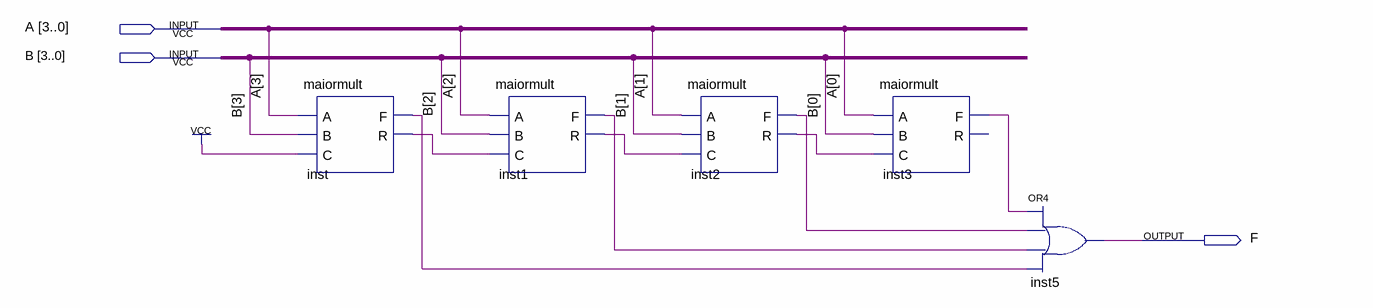
[diagram p0: schematic sheet]
// Quartus schematic maior4bit.bdf as structural Verilog: 5 symbols, 3 pins
module maior4bit (
  input  [3:0] A,
  input  [3:0] B,
  output F
);

  wire inst1_f, inst1_r, inst2_f, inst2_r, inst3_f, inst_f, inst_r;

  maiormult inst (.A(A[3]), .B(B[3]), .C(1'b1), .F(inst_f), .R(inst_r));
  maiormult inst1 (.A(A[2]), .B(B[2]), .C(inst_r), .F(inst1_f), .R(inst1_r));
  maiormult inst2 (.A(A[1]), .B(B[1]), .C(inst1_r), .F(inst2_f), .R(inst2_r));
  maiormult inst3 (.A(A[0]), .B(B[0]), .C(inst2_r), .F(inst3_f));  // open: R
  or inst5 (F, inst3_f, inst2_f, inst1_f, inst_f);
endmodule
